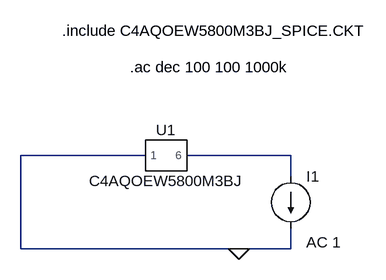
[diagram p0: schematic DC Link Cap Sim.asc]
DC Link Cap Sim.asc, the LTspice schematic file:
Version 4
SHEET 1 880 680
WIRE 384 288 192 288
WIRE 608 288 448 288
WIRE 608 320 608 288
WIRE 192 432 192 288
WIRE 528 432 192 432
WIRE 608 432 608 400
WIRE 608 432 528 432
FLAG 528 432 0
SYMBOL AutoGenerated/C4AQOEW5800M3BJ 416 288 R0
SYMATTR InstName U1
SYMBOL current 608 320 R0
WINDOW 123 24 102 Left 2
SYMATTR InstName I1
SYMATTR Value ""
SYMATTR Value2 AC 1
TEXT 256 96 Left 2 !.include C4AQOEW5800M3BJ_SPICE.CKT
TEXT 360 152 Left 2 !.ac dec 100 100 1000k

The netlist it stands for:
* DC Link Cap Sim.asc
XU1 0 N001 C4AQOEW5800M3BJ  ; pins 1 6
I1 N001 0 AC 1
.include C4AQOEW5800M3BJ_SPICE.CKT
.ac dec 100 100 1000k
.lib /Users/vladroiban/Documents/Inverter/LTSpice/C4AQOEW5800M3BJ_SPICE.CKT
.backanno
.end